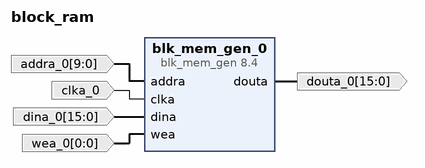
[diagram p0: block diagram of the top level]
# Vivado block design block_ram, xc7a100tcsg324-1, Vivado 2018.3
create_bd_design block_ram

create_bd_port -dir I -from 9 -to 0 addra_0
create_bd_port -dir I -type clk clka_0
create_bd_port -dir I -from 15 -to 0 dina_0
create_bd_port -dir O -from 15 -to 0 douta_0
create_bd_port -dir I -from 0 -to 0 wea_0

create_bd_cell -type ip -vlnv xilinx.com:ip:blk_mem_gen:8.4 blk_mem_gen_0
set_property -dict [list \
  CONFIG.Enable_32bit_Address false \
  CONFIG.Enable_A Always_Enabled \
  CONFIG.Fill_Remaining_Memory_Locations true \
  CONFIG.Read_Width_A 16 \
  CONFIG.Register_PortA_Output_of_Memory_Primitives true \
  CONFIG.Use_Byte_Write_Enable false \
  CONFIG.Use_RSTA_Pin false \
  CONFIG.Write_Depth_A 1024 \
  CONFIG.Write_Width_A 16 \
  CONFIG.use_bram_block Stand_Alone \
] [get_bd_cells blk_mem_gen_0]

# ---- connections ----

connect_bd_net -net addra_0_1 [get_bd_ports addra_0] [get_bd_pins blk_mem_gen_0/addra]
connect_bd_net -net clka_0_1 [get_bd_ports clka_0] [get_bd_pins blk_mem_gen_0/clka]
connect_bd_net -net dina_0_1 [get_bd_ports dina_0] [get_bd_pins blk_mem_gen_0/dina]
connect_bd_net [get_bd_pins blk_mem_gen_0/douta] [get_bd_ports douta_0]
connect_bd_net -net wea_0_1 [get_bd_ports wea_0] [get_bd_pins blk_mem_gen_0/wea]

validate_bd_design
save_bd_design
